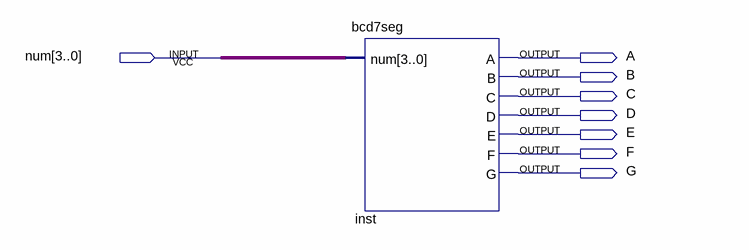
[diagram p0: schematic sheet]
// Quartus schematic bcd_7_segment.bdf as structural Verilog: 1 symbols, 8 pins
module bcd_7_segment (
  input  [3:0] num,
  output A,
  output B,
  output C,
  output D,
  output E,
  output F,
  output G
);

  bcd7seg inst (.num(num), .A(A), .B(B), .C(C), .D(D), .E(E), .F(F), .G(G));
endmodule
